# Altium project LTC2949-LTC8315.PrjPcb
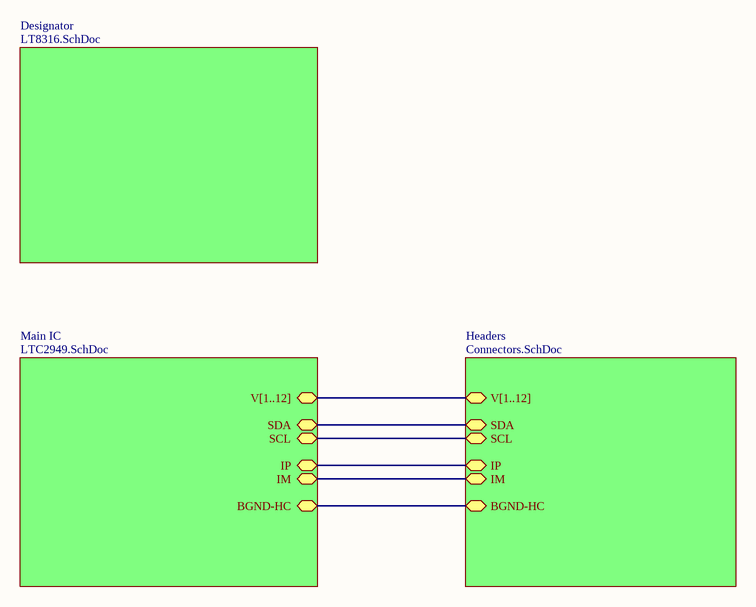
[diagram p0: Main.SchDoc]
4 sheets, 76 parts. Net scope: hierarchical (ports join the sheet entries above them; power ports are global).
Board file: LTC_Test_Board.PcbDoc
Sheets:
  Main.SchDoc
    Main IC = LTC2949.SchDoc
    Headers = Connectors.SchDoc
    Designator = LT8316.SchDoc

## Sheet Main.SchDoc: Main
size A4; Author: Ben H; Organization: Waterloop; Address1: 200 University Ave W; Address2: Engineering 5, 1104; Address3: Waterloo, ON; Address4: N2L 3G1; Revision: B; SheetNumber: 1; SheetTotal: 4

### Sub-sheets
Designator = LT8316.SchDoc: no entries
Headers = Connectors.SchDoc: IP (bidir), IM (bidir), SDA (bidir), SCL (bidir), V[1..12] (bidir), BGND-HC (bidir)
Main IC = LTC2949.SchDoc: IP (bidir), IM (bidir), SDA (bidir), SCL (bidir), V[1..12] (bidir), BGND-HC (bidir)

### Nets
NetP7_1: sheet Main IC/IP, sheet Headers/IP
NetP7_2: sheet Main IC/IM, sheet Headers/IM
NetP8_1: sheet Main IC/SDA, sheet Headers/SDA
NetP8_2: sheet Main IC/SCL, sheet Headers/SCL
NetP9_2: sheet Main IC/BGND-HC, sheet Headers/BGND-HC

### Buses and harness runs
bus sheet Headers/V[1..12] = sheet Main IC/V[1..12]

### Notes on the sheet
- Title
- Size:
- Date:
- A4
- Author:
- Time:
- Revision:
- Sheet
- of
- File:

## Sheet LTC2949.SchDoc: LTC2949
size A4; Author: Andrea P; Organization: Waterloop; Address1: 200 University Ave W; Address2: Engineering 5, 1104; Address3: Waterloo, ON; Address4: N2L 3G1; Revision: B; SheetNumber: 2; SheetTotal: 4
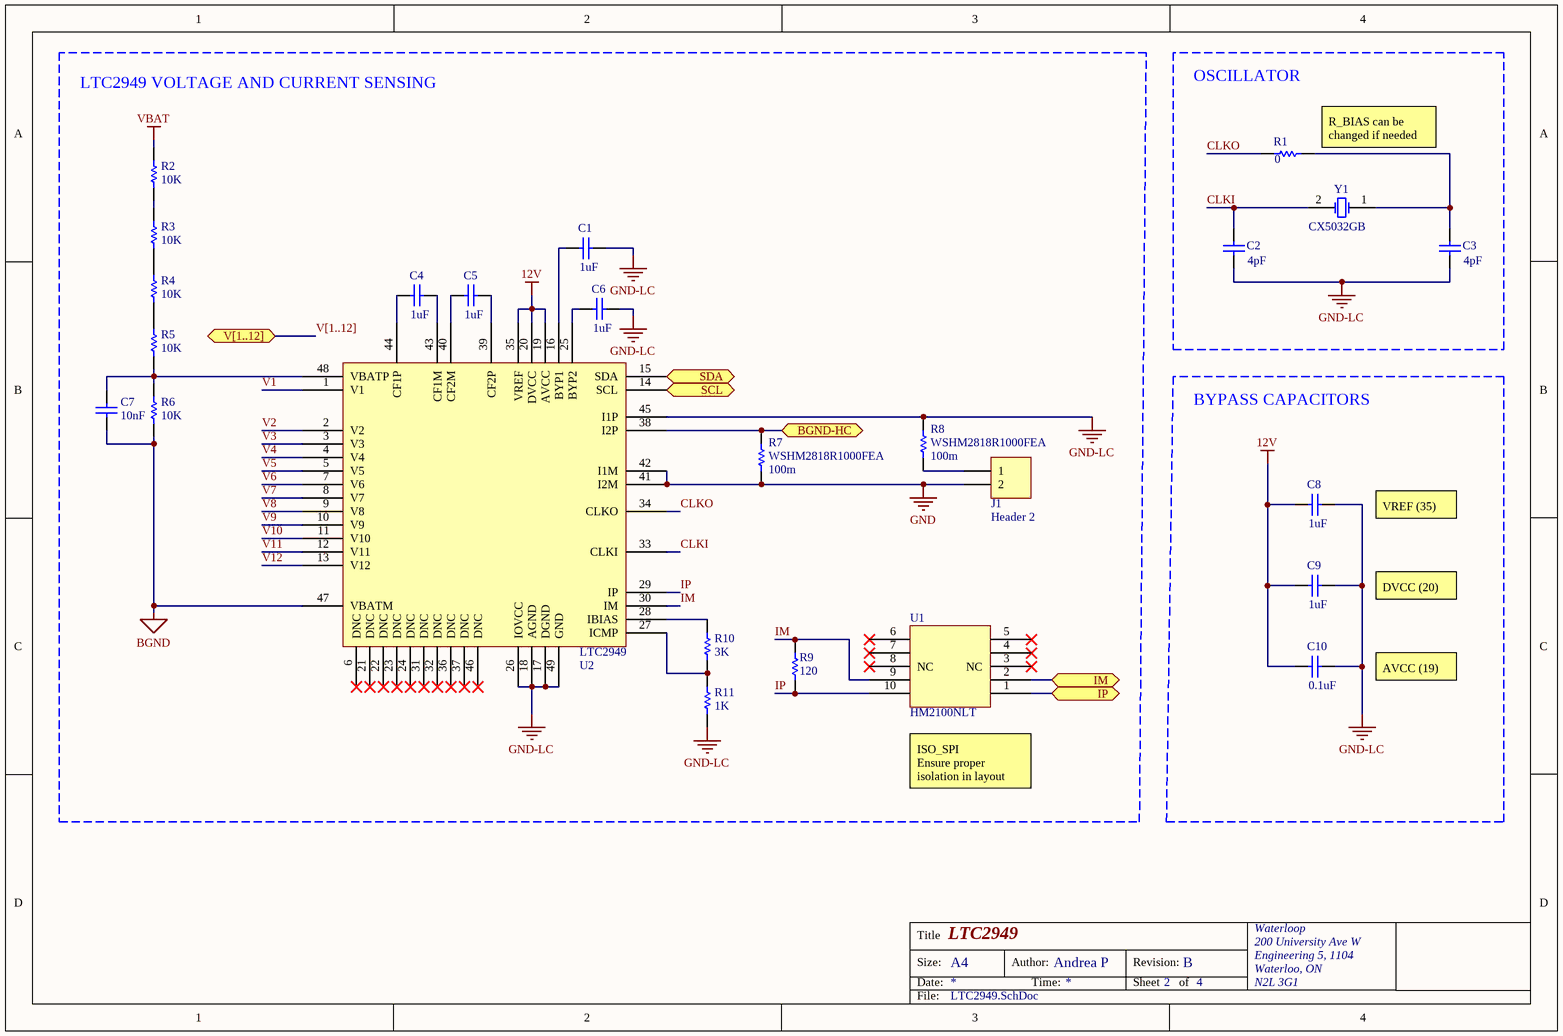
[diagram p1: LTC2949.SchDoc]

### Parts
C1  value 1uF  [C0805]  (hidden comment: Cap)
C2  value 4pF  [C0805]  (hidden comment: 50V)
C3  value 4pF  [C0805]  (hidden comment: 50V)
C4  value 1uF  [C0805]  (hidden comment: Cap)
C5  value 1uF  [C0805]  (hidden comment: Cap)
C6  value 1uF  [C0805]  (hidden comment: Cap)
C7  value 10nF  [C0805]  (hidden comment: Cap)
C8  value 1uF  [C0805]  (hidden comment: Cap)
C9  value 1uF  [C0805]  (hidden comment: Cap)
C10  value 0.1uF  [C0805]  (hidden comment: Cap)
J1  Header 2  [HDR1X2]
R1  value 0  [J1-0603]  (hidden comment: 0603)
R2  value 10K  [J1-0603]  (hidden comment: Res1)
R3  value 10K  [J1-0603]  (hidden comment: Res1)
R4  value 10K  [J1-0603]  (hidden comment: Res1)
R5  value 10K  [J1-0603]  (hidden comment: Res1)
R6  value 10K  [J1-0603]  (hidden comment: Res1)
R7  value 100m  Part Number: WSHM2818R1000FEA  [2818]  (hidden comment: Res1)
R8  value 100m  Part Number: WSHM2818R1000FEA  [2818]  (hidden comment: Res1)
R9  value 120  [J1-0603]  (hidden comment: 1%)
R10  value 3K  [J1-0603]  (hidden comment: 1%)
R11  value 1K  [J1-0603]  (hidden comment: 1%)
U1  HM2100NLT  [HM2100NLT]
U2  LTC2949  [LTC2949]
Y1  CX5032GB  [CX5032GB08000H0HPQZ1]

### Blocks framed on the sheet
LTC2949 VOLTAGE AND CURRENT SENSING: C1 C4-C7 J1 R2-R11 U1 U2
OSCILLATOR: C2 C3 R1 Y1
BYPASS CAPACITORS: C8-C10

### Ports
BGND-HC (bidir), IM (bidir), IP (bidir), SCL (bidir), SDA (bidir), V[1..12] (bidir)

### Nets
12V: C8.1 C9.1 C10.1 U2.19(AVCC) U2.20(DVCC) U2.35(VREF)
BGND: C7.1 R6.1 U2.47(VBATM)
GND: J1.2 R7.1 U2.41(I2M) U2.42(I1M)
GND-LC: C1.2 C2.1 C3.1 C6.2 C8.2 C9.2 C10.2 R8.2 R11.2 U2.17(DGND) U2.18(AGND) U2.26(IOVCC) U2.45(I1P) U2.49(GND)
VBAT: R2.2
CLKI: C2.2 U2.33(CLKI) Y1.2(OSC2)
CLKO: R1.1 U2.34(CLKO)
IM: R9.2 U1.9 U2.30(IM)
IP: R9.1 U1.10 U2.29(IP)
V1: U2.1(V1)
V2: U2.2(V2)
V3: U2.3(V3)
V4: U2.4(V4)
V5: U2.5(V5)
V6: U2.7(V6)
V7: U2.8(V7)
V8: U2.9(V8)
V9: U2.10(V9)
V10: U2.11(V10)
V11: U2.12(V11)
V12: U2.13(V12)
NetC1_1: C1.1 U2.16(BYP1)
NetC3_2: C3.2 R1.2 Y1.1(OSC1)
NetC4_1: C4.1 U2.44(CF1P)
NetC4_2: C4.2 U2.43(CF1M)
NetC5_1: C5.1 U2.40(CF2M)
NetC5_2: C5.2 U2.39(CF2P)
NetC6_1: C6.1 U2.25(BYP2)
NetC7_2: C7.2 R5.1 R6.2 U2.48(VBATP)
NetJ1_1: J1.1 R8.1
NetP7_1: U1.1 ; port IP
NetP7_2: U1.2 ; port IM
NetP8_1: U2.15(SDA) ; port SDA
NetP8_2: U2.14(SCL) ; port SCL
NetP9_2: R7.2 U2.38(I2P) ; port BGND-HC
NetR2_1: R2.1 R3.2
NetR3_1: R3.1 R4.2
NetR4_1: R4.1 R5.2
NetR10_1: R10.1 R11.1 U2.27(ICMP)
NetR10_2: R10.2 U2.28(IBIAS)

Not connected (* = marked no-connect by the designer): U1 3(NC)* 4* 5* 6* 7* 8(NC)*; U2 6(DNC)* 21(DNC)* 22(DNC)* 23(DNC)* 24(DNC)* 31(DNC)* 32(DNC)* 36(DNC)* 37(DNC)* 46(DNC)*

### Buses and harness runs
bus V[1..12] = port V[1..12]

### Notes on the sheet
- (near R1) R_BIAS can be changed if needed
- VREF (35)
- DVCC (20)
- AVCC (19)
- (near U1) ISO_SPI
  Ensure proper isolation in layout
- Title
- Size:
- Date:
- A4
- Author:
- Time:
- Revision:
- Sheet
- of
- File:

### Library data of the parts
C1 C4-C10 = Cap: Capacitor; Published: 8-Jun-2000; LatestRevisionDate: 17-Jul-2002; LatestRevisionNote: Re-released for DXP Platform.; PackageReference: RAD-0.3; Publisher: Altium Limited; PackageDescription: Radial Cap, Thru-Hole; 2 Leads; 0.3 in Pin Spacing
C2 = Cap: CBR08C409B5GAC. 4pF ±0.1pF 50V Ceramic Capacitor C0G, NP0 0805 (2012 Metric); Published: 8-Jun-2000; LatestRevisionDate: 17-Jul-2002; LatestRevisionNote: Re-released for DXP Platform.; PackageReference: RAD-0.3; Publisher: Altium Limited; PackageDescription: Radial Cap, Thru-Hole; 2 Leads; 0.3 in Pin Spacing
C3 = Cap: CBR08C409B5GAC; Published: 8-Jun-2000; LatestRevisionDate: 17-Jul-2002; LatestRevisionNote: Re-released for DXP Platform.; PackageReference: RAD-0.3; Publisher: Altium Limited; PackageDescription: Radial Cap, Thru-Hole; 2 Leads; 0.3 in Pin Spacing
J1 = Header 2: Header, 2-Pin; LatestRevisionDate: 17-Jul-2002; LatestRevisionNote: Re-released for DXP Platform.; Publisher: Altium Limited
R1 = Res1: ERJ-U030R00V. 0 Ohms Jumper 0.1W, 1/10W Chip Resistor 0603 (1608 Metric) Anti-Sulfur, Automotive AEC-Q200 Thick Film; Published: 8-Jun-2000; LatestRevisionDate: 17-Jul-2002; LatestRevisionNote: Re-released for DXP Platform.; PackageReference: AXIAL-0.3; Publisher: Altium Limited; PackageDescription: Axial Device, Thru-Hole; 2 Leads; 0.3 in Pin Spacing
R2-R11 = Res1: Resistor; Published: 8-Jun-2000; LatestRevisionDate: 17-Jul-2002; LatestRevisionNote: Re-released for DXP Platform.; PackageReference: AXIAL-0.3; Publisher: Altium Limited; PackageDescription: Axial Device, Thru-Hole; 2 Leads; 0.3 in Pin Spacing
Y1 = XTAL: 8MHz ±20ppm Crystal 12pF 300 Ohms 2-SMD, No Lead /; Published: 8-Jun-2000; LatestRevisionDate: 17-Jul-2002; LatestRevisionNote: Re-released for DXP Platform.; PackageReference: R38; Publisher: Altium Limited; PackageDescription: Crystal, Thru-Hole; 2 Leads; Body 3.1 x 8.2 mm (Dia.xH)

## Sheet Connectors.SchDoc: External Connectors
size A4; Author: Andrea P; Organization: Waterloop; Address1: 200 University Ave W; Address2: Engineering 5, 1104; Address3: Waterloo, ON; Address4: N2L 3G1; Revision: B; SheetNumber: 4; SheetTotal: 4
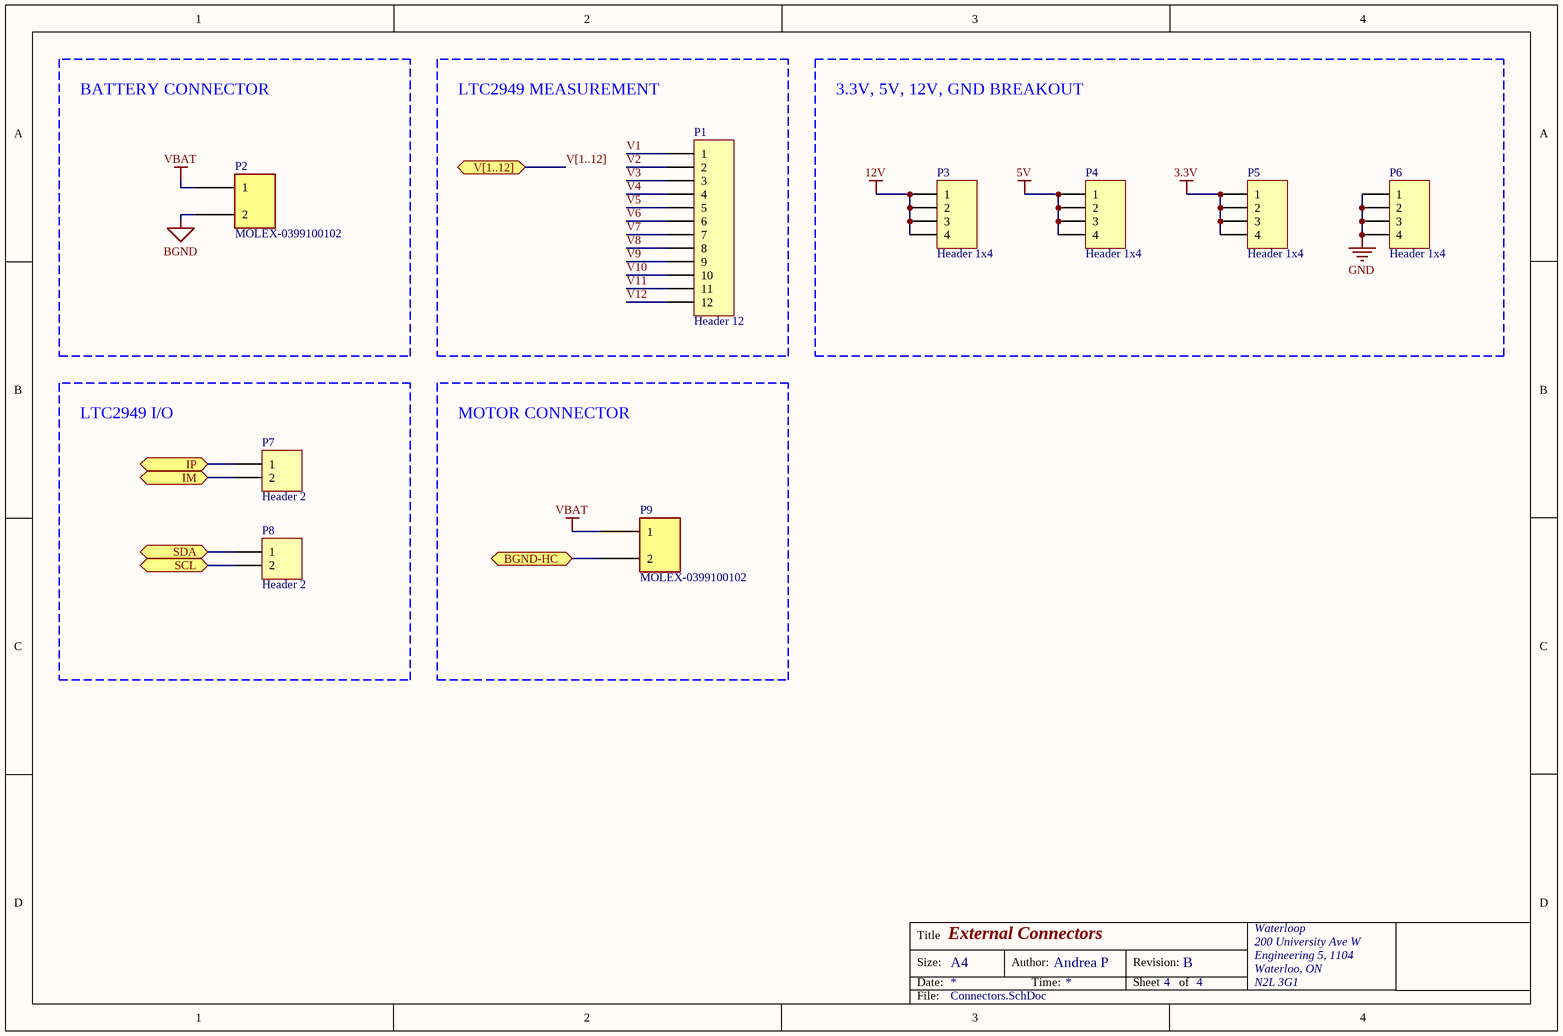
[diagram p2: Connectors.SchDoc]

### Parts
P1  Header 12  [HDR1X12]
P2  MOLEX-0399100102  [PHOENIX-1017531]
P3  Header 1x4  [HDR1X4]
P4  Header 1x4  [HDR1X4]
P5  Header 1x4  [HDR1X4]
P6  Header 1x4  [HDR1X4]
P7  Header 2  [HDR1X2]
P8  Header 2  [HDR1X2]
P9  MOLEX-0399100102  [PHOENIX-1017531]

### Blocks framed on the sheet
BATTERY CONNECTOR: P2
LTC2949 MEASUREMENT: P1
3.3V, 5V, 12V, GND BREAKOUT: P3-P6
LTC2949 I/O: P7 P8
MOTOR CONNECTOR: P9

### Ports
BGND-HC (bidir), IM (bidir), IP (bidir), SCL (bidir), SDA (bidir), V[1..12] (bidir)

### Nets
3.3V: P5.1 P5.2 P5.3 P5.4
5V: P4.1 P4.2 P4.3 P4.4
12V: P3.1 P3.2 P3.3 P3.4
BGND: P2.2
GND: P6.1 P6.2 P6.3 P6.4
VBAT: P2.1 P9.1
V1: P1.1
V2: P1.2
V3: P1.3
V4: P1.4
V5: P1.5
V6: P1.6
V7: P1.7
V8: P1.8
V9: P1.9
V10: P1.10
V11: P1.11
V12: P1.12
NetP7_1: P7.1 ; port IP
NetP7_2: P7.2 ; port IM
NetP8_1: P8.1 ; port SDA
NetP8_2: P8.2 ; port SCL
NetP9_2: P9.2 ; port BGND-HC

### Buses and harness runs
bus V[1..12] = port V[1..12]

### Notes on the sheet
- Title
- Size:
- Date:
- A4
- Author:
- Time:
- Revision:
- Sheet
- of
- File:

### Library data of the parts
P1 = Header 12: Header, 12-Pin; LatestRevisionDate: 17-Jul-2002; LatestRevisionNote: Re-released for DXP Platform.; Publisher: Altium Limited
P2 P9 = MOLEX-0399100102: TERM BLK 2P SIDE ENT 10.16MM PCB
P3-P6 = Header 4: Header, 4-Pin; LatestRevisionDate: 17-Jul-2002; LatestRevisionNote: Re-released for DXP Platform.; Publisher: Altium Limited
P7 P8 = Header 2: Header, 2-Pin; LatestRevisionDate: 17-Jul-2002; LatestRevisionNote: Re-released for DXP Platform.; Publisher: Altium Limited

## Sheet LT8316.SchDoc: LT8316
size A4; Author: Gurubaani; Organization: Waterloop; Address1: 200 University Ave W; Address2: Engineering 5, 1104; Address3: Waterloo, ON; Address4: N2L 3G1; Revision: C; SheetNumber: 3; SheetTotal: 4
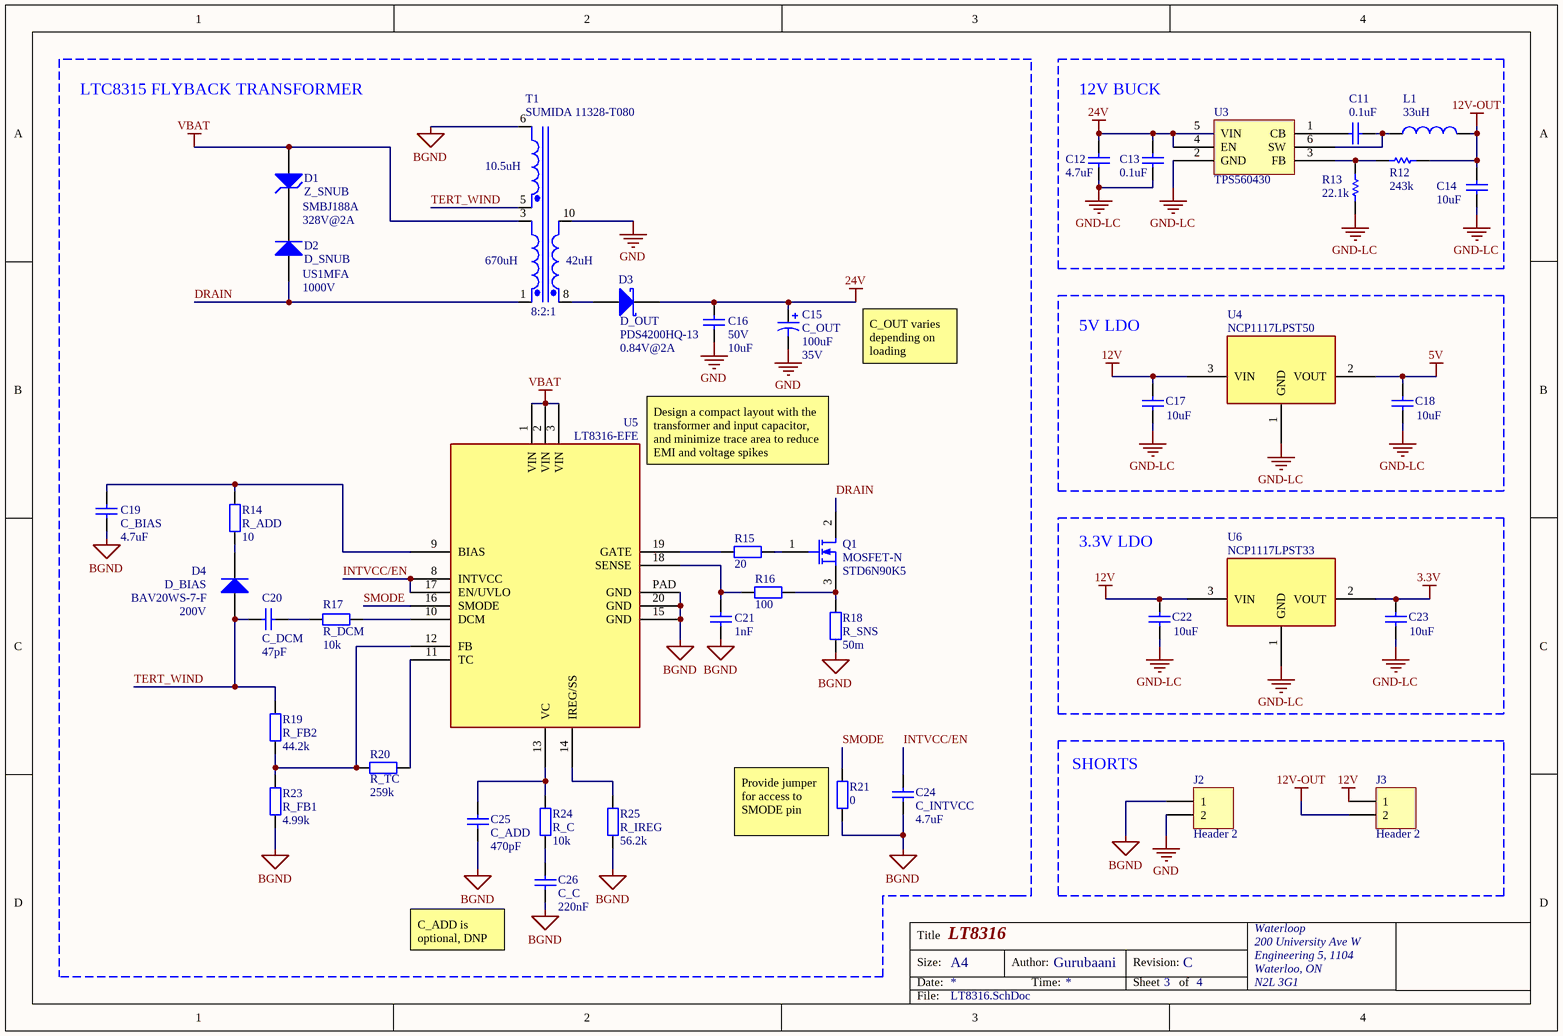
[diagram p3: LT8316.SchDoc]

### Parts
C11  value 0.1uF  [C0805]  (hidden comment: C_OUT)
C12  value 4.7uF  [C0805]  (hidden comment: C_OUT)
C13  value 0.1uF  [C0805]  (hidden comment: C_OUT)
C14  value 10uF  [C0805]  (hidden comment: C_OUT)
C15  C_OUT  value 100uF  Voltage: 35V  [RB7.6-15]
C16  value 10uF  Voltage: 50V  [C0805]  (hidden comment: C_OUT)
C17  value 10uF  [C0805]  (hidden comment: C_OUT)
C18  value 10uF  [C0805]  (hidden comment: C_OUT)
C19  C_BIAS  value 4.7uF  [C0805]
C20  C_DCM  value 47pF  [C0805]
C21  value 1nF  [C0805]  (hidden comment: C_OUT)
C22  value 10uF  [C0805]  (hidden comment: C_OUT)
C23  value 10uF  [C0805]  (hidden comment: C_OUT)
C24  C_INTVCC  value 4.7uF  [C0805]
C25  C_ADD  value 470pF  [C0805]
C26  C_C  value 220nF  [C0805]
D1  Z_SNUB  Reverse Voltage: 328V@2A  PartNumber: SMBJ188A  [DO-214AA, SMB]
D2  D_SNUB  Reverse Voltage: 1000V  PartNumber: US1MFA  [SOD-123FL]
D3  D_OUT  Forward Voltage: 0.84V@2A  PartNumber: PDS4200HQ-13  [POWERDI5 (DPAK184P650X115-3N)]
D4  D_BIAS  Reverse Voltage: 200V  PartNumber: BAV20WS-7-F  [SOD323]
J2  Header 2  [HDR1X2]
J3  Header 2  [HDR1X2]
L1  value 33uH  [INDC4532]  (hidden comment: Inductor)
Q1  MOSFET-N  Part Number: STD6N90K5  [DPAK (228P972X240-3N)]
R12  value 243k  [J1-0603]  (hidden comment: Res1)
R13  value 22.1k  [J1-0603]  (hidden comment: Res1)
R14  R_ADD  value 10  [J1-0603]
R15  value 20  [J1-0603]  (hidden comment: R_SNS)
R16  value 100  [J1-0603]  (hidden comment: R_SNS)
R17  R_DCM  value 10k  [J1-0603]
R18  R_SNS  value 50m  [J1-0603]
R19  R_FB2  value 44.2k  [J1-0603]
R20  R_TC  value 259k  [J1-0603]
R21  value 0  [J1-0603]  (hidden comment: R_C)
R23  R_FB1  value 4.99k  [J1-0603]
R24  R_C  value 10k  [J1-0603]
R25  R_IREG  value 56.2k  [J1-0603]
T1  8:2:1  Part Number: SUMIDA 11328-T080  Primary Inductance: 670uH  Secondary Inductance: 42uH  Tertiary Inducatance: 10.5uH  [PQ2620]
U3  TPS560430  [SOT23-6_N]
U4  NCP1117LPST50  [NCP1117LPST]
U5  LT8316-EFE  [LTC8315/8316]
U6  NCP1117LPST33  [NCP1117LPST]

### Blocks framed on the sheet
LTC8315 FLYBACK TRANSFORMER: C15 C16 C19-C21 C24-C26 D1-D4 Q1 R14-R21 R23-R25 T1 U5
12V BUCK: C11-C14 L1 R12 R13 U3
5V LDO: C17 C18 U4
3.3V LDO: C22 C23 U6
SHORTS: J2 J3

### Nets
3.3V: C23.2 U6.2(VOUT)
5V: C18.2 U4.2(VOUT)
12V: C17.2 C22.2 J3.1 U4.3(VIN) U6.3(VIN)
12V-OUT: C14.2 J3.2 L1.2 R12.1
24V: C12.2 C13.2 C15.1 C16.2 D3.2(K) U3.4(EN) U3.5(VIN)
BGND: C19.1 C21.1 C24.2 C25.1 C26.1 J2.1 R18.2 R21.1 R23.1 R25.1 T1.6(Sec2-) U5.15(GND) U5.20(GND) U5.PAD(GND)
GND: C15.2 C16.1 J2.2 T1.10(Pri-)
GND-LC: C12.1 C13.1 C14.1 C17.1 C18.1 C22.1 C23.1 R13.1 U3.2(GND) U4.1(GND) U6.1(GND)
VBAT: D1.1(A) T1.3(Sec1-) U5.1(VIN) U5.2(VIN) U5.3(VIN)
DRAIN: D2.1(A) Q1.2(D) T1.1(Sec1+)
INTVCC/EN: C24.1 U5.8(INTVCC) U5.17(EN/UVLO)
SMODE: R21.2 U5.16(SMODE)
TERT_WIND: C20.1 D4.1(A) R19.2 T1.5(Sec2+)
NetC11_1: C11.1 L1.1 U3.6(SW)
NetC11_2: C11.2 U3.1(CB)
NetC19_2: C19.2 R14.1 U5.9(BIAS)
NetC20_2: C20.2 R17.2
NetC21_2: C21.2 R16.1 U5.18(SENSE)
NetC25_2: C25.2 R24.2 U5.13(VC)
NetC26_2: C26.2 R24.1
NetD1_2: D1.2(K) D2.2(K)
NetD3_1: D3.1(A) T1.8(Pri+)
NetD4_2: D4.2(K) R14.2
NetQ1_1: Q1.1(G) R15.2
NetQ1_3: Q1.3(S) R16.2 R18.1
NetR12_2: R12.2 R13.2 U3.3(FB)
NetR15_1: R15.1 U5.19(GATE)
NetR17_1: R17.1 U5.10(DCM)
NetR19_1: R19.1 R20.2 R23.2 U5.12(FB)
NetR20_1: R20.1 U5.11(TC)
NetR25_2: R25.2 U5.14(IREG/SS)

### Notes on the sheet
- C_OUT varies depending on loading
- (near U5) Design a compact layout with the transformer and input capacitor, and minimize trace area to reduce EMI and voltage spikes
- (near R21) Provide jumper for access to SMODE pin
- (near C26) C_ADD is optional, DNP
- Title
- Size:
- Date:
- A4
- Author:
- Time:
- Revision:
- Sheet
- of
- File:

### Library data of the parts
C11-C14 C16-C26 = Cap: Capacitor; Published: 8-Jun-2000; LatestRevisionDate: 17-Jul-2002; LatestRevisionNote: Re-released for DXP Platform.; PackageReference: RAD-0.3; Publisher: Altium Limited; PackageDescription: Radial Cap, Thru-Hole; 2 Leads; 0.3 in Pin Spacing
C15 = Cap Pol1: Polarized Capacitor (Radial); Published: 8-Jun-2000; LatestRevisionDate: 17-Jul-2002; LatestRevisionNote: Re-released for DXP Platform.; PackageReference: RB7.6-15; Publisher: Altium Limited; PackageDescription: Polarized Capacitor (Radial); 2 Leads
D1 = D Zener: Zener Diode
D2 D4 = Diode: Default Diode
D3 = D Schottky: Schottky Diode
J2 J3 = Header 2: Header, 2-Pin; LatestRevisionDate: 17-Jul-2002; LatestRevisionNote: Re-released for DXP Platform.; Publisher: Altium Limited
L1 = Inductor: Code_IEC: 1005; Published: 8-Jun-2000; LatestRevisionDate: 29-May-2009; LatestRevisionNote: IPC-7351 Footprint Added.; PackageReference: 0402-A; Publisher: Altium Limited; PackageDescription: Chip Inductor; Code_JEITA: 0402
Q1 = MOSFET-N: N-Channel MOSFET; Published: 8-Jun-2000; LatestRevisionDate: 17-Jul-2002; LatestRevisionNote: Re-released for DXP Platform.; PackageVersion: 1995/1996; PackageReference: E3; Publisher: Altium Limited; PackageDescription: TO, Flat Index; 3 In-Line, Axial Leads; Body Dia. 4.6mm; Lead Dia. 0.5 mm (max)
R12 R13 = Res1: Resistor; Published: 8-Jun-2000; LatestRevisionDate: 17-Jul-2002; LatestRevisionNote: Re-released for DXP Platform.; PackageReference: AXIAL-0.3; Publisher: Altium Limited; PackageDescription: Axial Device, Thru-Hole; 2 Leads; 0.3 in Pin Spacing
R14-R21 R23-R25 = Res2: Resistor; Published: 8-Jun-2000; LatestRevisionDate: 17-Jul-2002; LatestRevisionNote: Re-released for DXP Platform.; PackageReference: AXIAL-0.4; Publisher: Altium Limited; PackageDescription: Axial Device, Thru-Hole; 2 Leads; 0.4 in Pin Spacing
T1 = Trans3: Three-winding Transformer (Non-Ideal); Published: 25-Jan-2001; LatestRevisionDate: 17-Jul-2002; LatestRevisionNote: Re-released for DXP Platform.
U3 = TPS560430: IC REG BUCK PFM 600MA SOT23-6
U4 = NCP1117LPST50: IC REG LINEAR 5V 1A SOT223
U5 = LT8316-EFE: 600VIN MICROPOWER, ISOLATED NO-O
U6 = NCP1117LPST33: IC REG LINEAR 3.3V 1A SOT223

## Nets that join several sheets
3.3V: Connectors (P5.1 P5.2 P5.3 P5.4), LT8316 (C23.2 U6.2)
5V: Connectors (P4.1 P4.2 P4.3 P4.4), LT8316 (C18.2 U4.2)
12V: LTC2949 (6 pins), Connectors (P3.1 P3.2 P3.3 P3.4), LT8316 (5 pins)
BGND: LTC2949 (C7.1 R6.1 U2.47), Connectors (P2.2), LT8316 (14 pins)
GND: LTC2949 (J1.2 R7.1 U2.41 U2.42), Connectors (P6.1 P6.2 P6.3 P6.4), LT8316 (C15.2 C16.1 J2.2 T1.10)
GND-LC: LTC2949 (14 pins), LT8316 (11 pins)
VBAT: LTC2949 (R2.2), Connectors (P2.1 P9.1), LT8316 (5 pins)
NetP7_1: LTC2949 (U1.1), Connectors (P7.1)
NetP7_2: LTC2949 (U1.2), Connectors (P7.2)
NetP8_1: LTC2949 (U2.15), Connectors (P8.1)
NetP8_2: LTC2949 (U2.14), Connectors (P8.2)
NetP9_2: LTC2949 (R7.2 U2.38), Connectors (P9.2)
V1: LTC2949 (U2.1), Connectors (P1.1)
V2: LTC2949 (U2.2), Connectors (P1.2)
V3: LTC2949 (U2.3), Connectors (P1.3)
V4: LTC2949 (U2.4), Connectors (P1.4)
V5: LTC2949 (U2.5), Connectors (P1.5)
V6: LTC2949 (U2.7), Connectors (P1.6)
V7: LTC2949 (U2.8), Connectors (P1.7)
V8: LTC2949 (U2.9), Connectors (P1.8)
V9: LTC2949 (U2.10), Connectors (P1.9)
V10: LTC2949 (U2.11), Connectors (P1.10)
V11: LTC2949 (U2.12), Connectors (P1.11)
V12: LTC2949 (U2.13), Connectors (P1.12)